# Altium schematic sheet p3_fan_regulator.SchDoc
size A4; Organization: Protel International P/L; Address1: L3, 12a Rodborough Rd; Address2: Frenchs Forest; Address3: NSW; Address4: Australia 2086
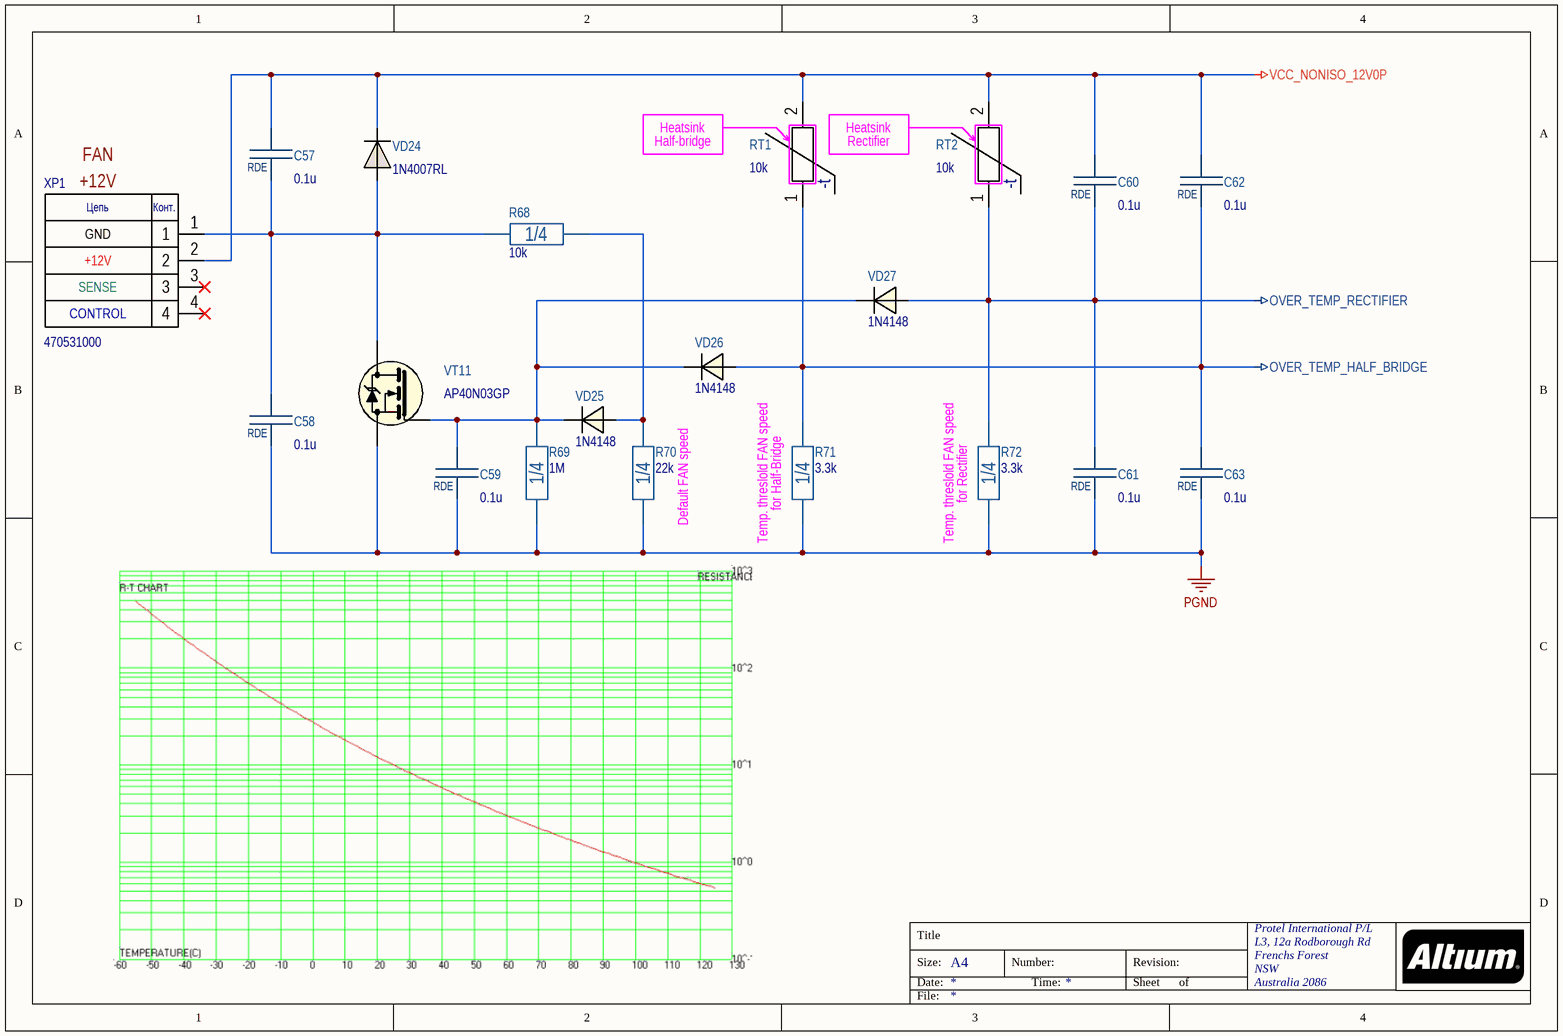
[diagram p0: p3_fan_regulator.SchDoc]

## Parts
C57  0.1u  Package: RDE  [RDE_1P1]
C58  0.1u  Package: RDE  [RDE_1P1]
C59  0.1u  Package: RDE  [RDE_1P1]
C60  0.1u  Package: RDE  [RDE_1P1]
C61  0.1u  Package: RDE  [RDE_1P1]
C62  0.1u  Package: RDE  [RDE_1P1]
C63  0.1u  Package: RDE  [RDE_1P1]
R68  10k  Package: 1/4  [CFR-25]
R69  1M  Package: 1/4  [CFR-25(VERTICAL)]
R70  22k  Package: 1/4  [CFR-25(VERTICAL)]
R71  3.3k  Package: 1/4  [CFR-25(VERTICAL)]
R72  3.3k  Package: 1/4  [CFR-25(VERTICAL)]
RT1  value 10k  [NTC_D8]  (hidden comment: *)
RT2  value 10k  [NTC_D8]  (hidden comment: *)
VD24  1N4007RL  [DO-41]
VD25  1N4148  [DO-35 GLASS LIGHT RED]
VD26  1N4148  [DO-35 GLASS LIGHT RED]
VD27  1N4148  [DO-35 GLASS LIGHT RED]
VT11  AP40N03GP  [TO-220A-3]
XP1  470531000  [0470531000]

## Nets
OVER_TEMP_HALF_BRIDGE: C62.2 C63.1 R71.2 RT1.1 VD26.2
OVER_TEMP_RECTIFIER: C60.2 C61.1 R72.2 RT2.1 VD27.2
PGND: C58.2 C59.2 C61.2 C63.2 R69.1 R70.1 R71.1 R72.1 VT11.3(S)
VCC_NONISO_12V0P: C57.1 C60.1 C62.1 RT1.2 RT2.2 VD24.1(C) XP1.2
NetC57_2: C57.2 C58.1 R68.2 VD24.2(A) VT11.2(D) XP1.1
NetC59_1: C59.1 R69.2 VD25.1 VD26.1 VD27.1 VT11.1(G)
NetR68_1: R68.1 R70.2 VD25.2

Not connected (* = marked no-connect by the designer): XP1 3* 4*

## Notes on the sheet
- FAN
- +12V
- Heatsink
- Half-bridge
- (near RT1) Heatsink
- (near RT1) Rectifier
- Temp. threslold FAN speed
- (near R71) for Half-Bridge
- (near R72) Temp. threslold FAN speed
- (near R72) for Rectifier
- Default FAN speed
- Title
- Size:
- Date:
- A4
- Number:
- Time:
- Revision:
- Sheet
- of
- File:
- (in symbol 470531000) Цепь; Конт.; GND; +12V; SENSE; CONTROL
- (in symbol NTC) -t

## Library data of the parts
C57-C63 = RDE_CAP: MLCC radial lead type with epoxy coat (RDE Series); Part Number: RDER72A104K1P1H03B; Manufacturer: Murata; Tolerance: ± 10 %; Dielectric: X7R; Voltage: 100V; Value: 0.1u; Value on schem: 0.1u
R68 = CF25: Resistor 1/4W; Part Number: MFR-25FTF52-10K; Manufacturer: Yageo; Tolerance: ± 1 %; Voltage: 250V; Temperature Coefficient: ±100 ppm/°C; Value: 10k; Value on schem: 10k
R69 = CF25: Resistor 1/4W; Part Number: MFR-25FTF52-1M; Manufacturer: Yageo; Tolerance: ± 1 %; Voltage: 250V; Temperature Coefficient: ±100 ppm/°C; Value: 1M; Value on schem: 1M
R70 = CF25: Resistor 1/4W; Part Number: MFR-25FTF52-22K; Manufacturer: Yageo; Tolerance: ± 1 %; Voltage: 250V; Temperature Coefficient: ±100 ppm/°C; Value: 22k; Value on schem: 22k
R71 R72 = CF25: Resistor 1/4W; Part Number: MFR-25FTF52-3K3; Manufacturer: Yageo; Tolerance: ± 1 %; Voltage: 250V; Temperature Coefficient: ±100 ppm/°C; Value: 3.3k; Value on schem: 3.3k
RT1 RT2 = NTC: NTC thermistors; Package: *; Part Number: *
VD24 = 1N4007RL: 1A 1000V Standard Recovery Rectifiers Diode; Manufacturer: ON Semiconductor; Part Number: 1N4007RL; Package: DO-41
VD25-VD27 = 1N4148: High-speed diode; Package: DO-35; Part Number: 1N4148
VT11 = AP40N03GP: N-Channel MOSFET,  30V, 40A; Manufacturer: Advanced Power Electronics Corp.; Part Number: AP40N03GP; Package: TO220-3
XP1 = 470531000: Designator: XP*; Part Number: 470531000